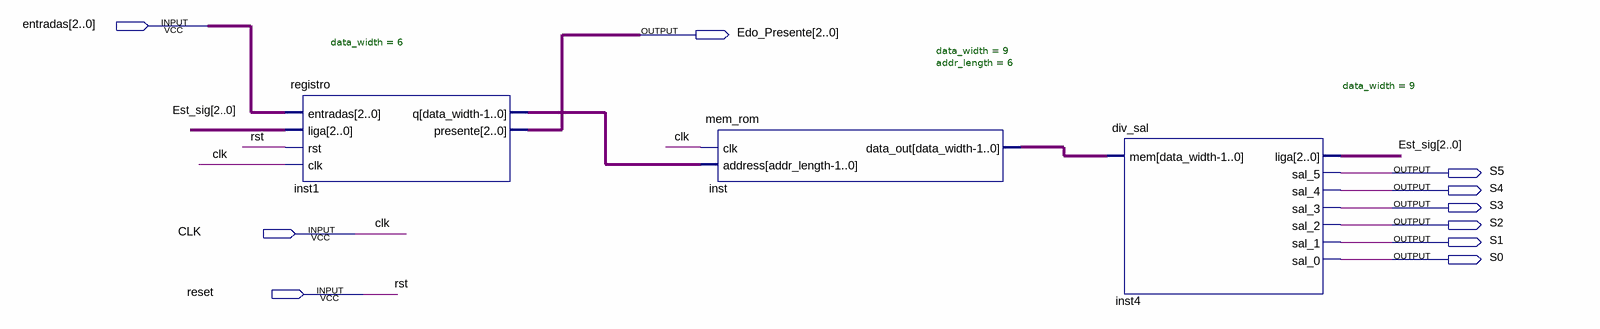
[diagram p0: schematic sheet]
// Quartus schematic practica3.bdf as structural Verilog: 3 symbols, 10 pins
module practica3 (
  input  [2:0] entradas,
  input  CLK,
  input  reset,
  output [2:0] Edo_Presente,
  output S5,
  output S4,
  output S3,
  output S2,
  output S1,
  output S0
);

  wire [2:0] Est_sig;
  wire [5:0] inst1_q;
  wire [8:0] inst_data_out;

  registro #(.data_width(6)) inst1 (
    .entradas(entradas), .liga(Est_sig), .rst(reset), .clk(CLK), .q(inst1_q), .presente(Edo_Presente));
  mem_rom #(.data_width(9), .addr_length(6)) inst (.clk(CLK), .address(inst1_q), .data_out(inst_data_out));
  div_sal #(.data_width(9)) inst4 (
    .mem(inst_data_out), .liga(Est_sig), .sal_5(S5), .sal_4(S4), .sal_3(S3), .sal_2(S2), .sal_1(S1),
    .sal_0(S0));

  // Other names for the same wires on the sheet: rst = reset
endmodule
